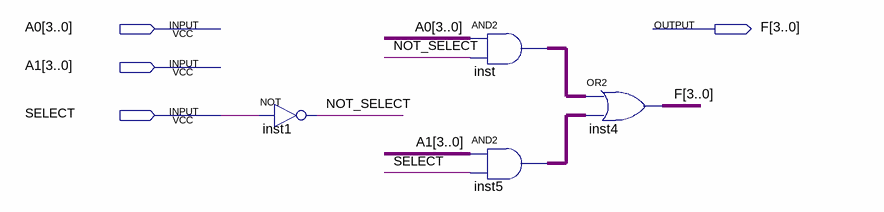
[diagram p0: schematic sheet]
// Quartus schematic MPX2_4.bdf as structural Verilog: 4 symbols, 4 pins
module MPX2_4 (
  input  [3:0] A0,
  input  [3:0] A1,
  input  SELECT,
  output [3:0] F
);

  wire NOT_SELECT;
  wire [3:0] inst5_out, inst_out;

  not inst1 (NOT_SELECT, SELECT);
  assign inst_out = A0 & {4{NOT_SELECT}};  // AND2 inst, 4 bits wide
  assign inst5_out = A1 & {4{SELECT}};  // AND2 inst5, 4 bits wide
  assign F = inst_out | inst5_out;  // OR2 inst4, 4 bits wide
endmodule
